# Altium schematic sheet Sheet1.SchDoc
size A3; Organization: Altium Limited; Address1: L3, 12a Rodborough Rd; Address2: Frenchs Forest; Address3: NSW; Address4: Australia 2086
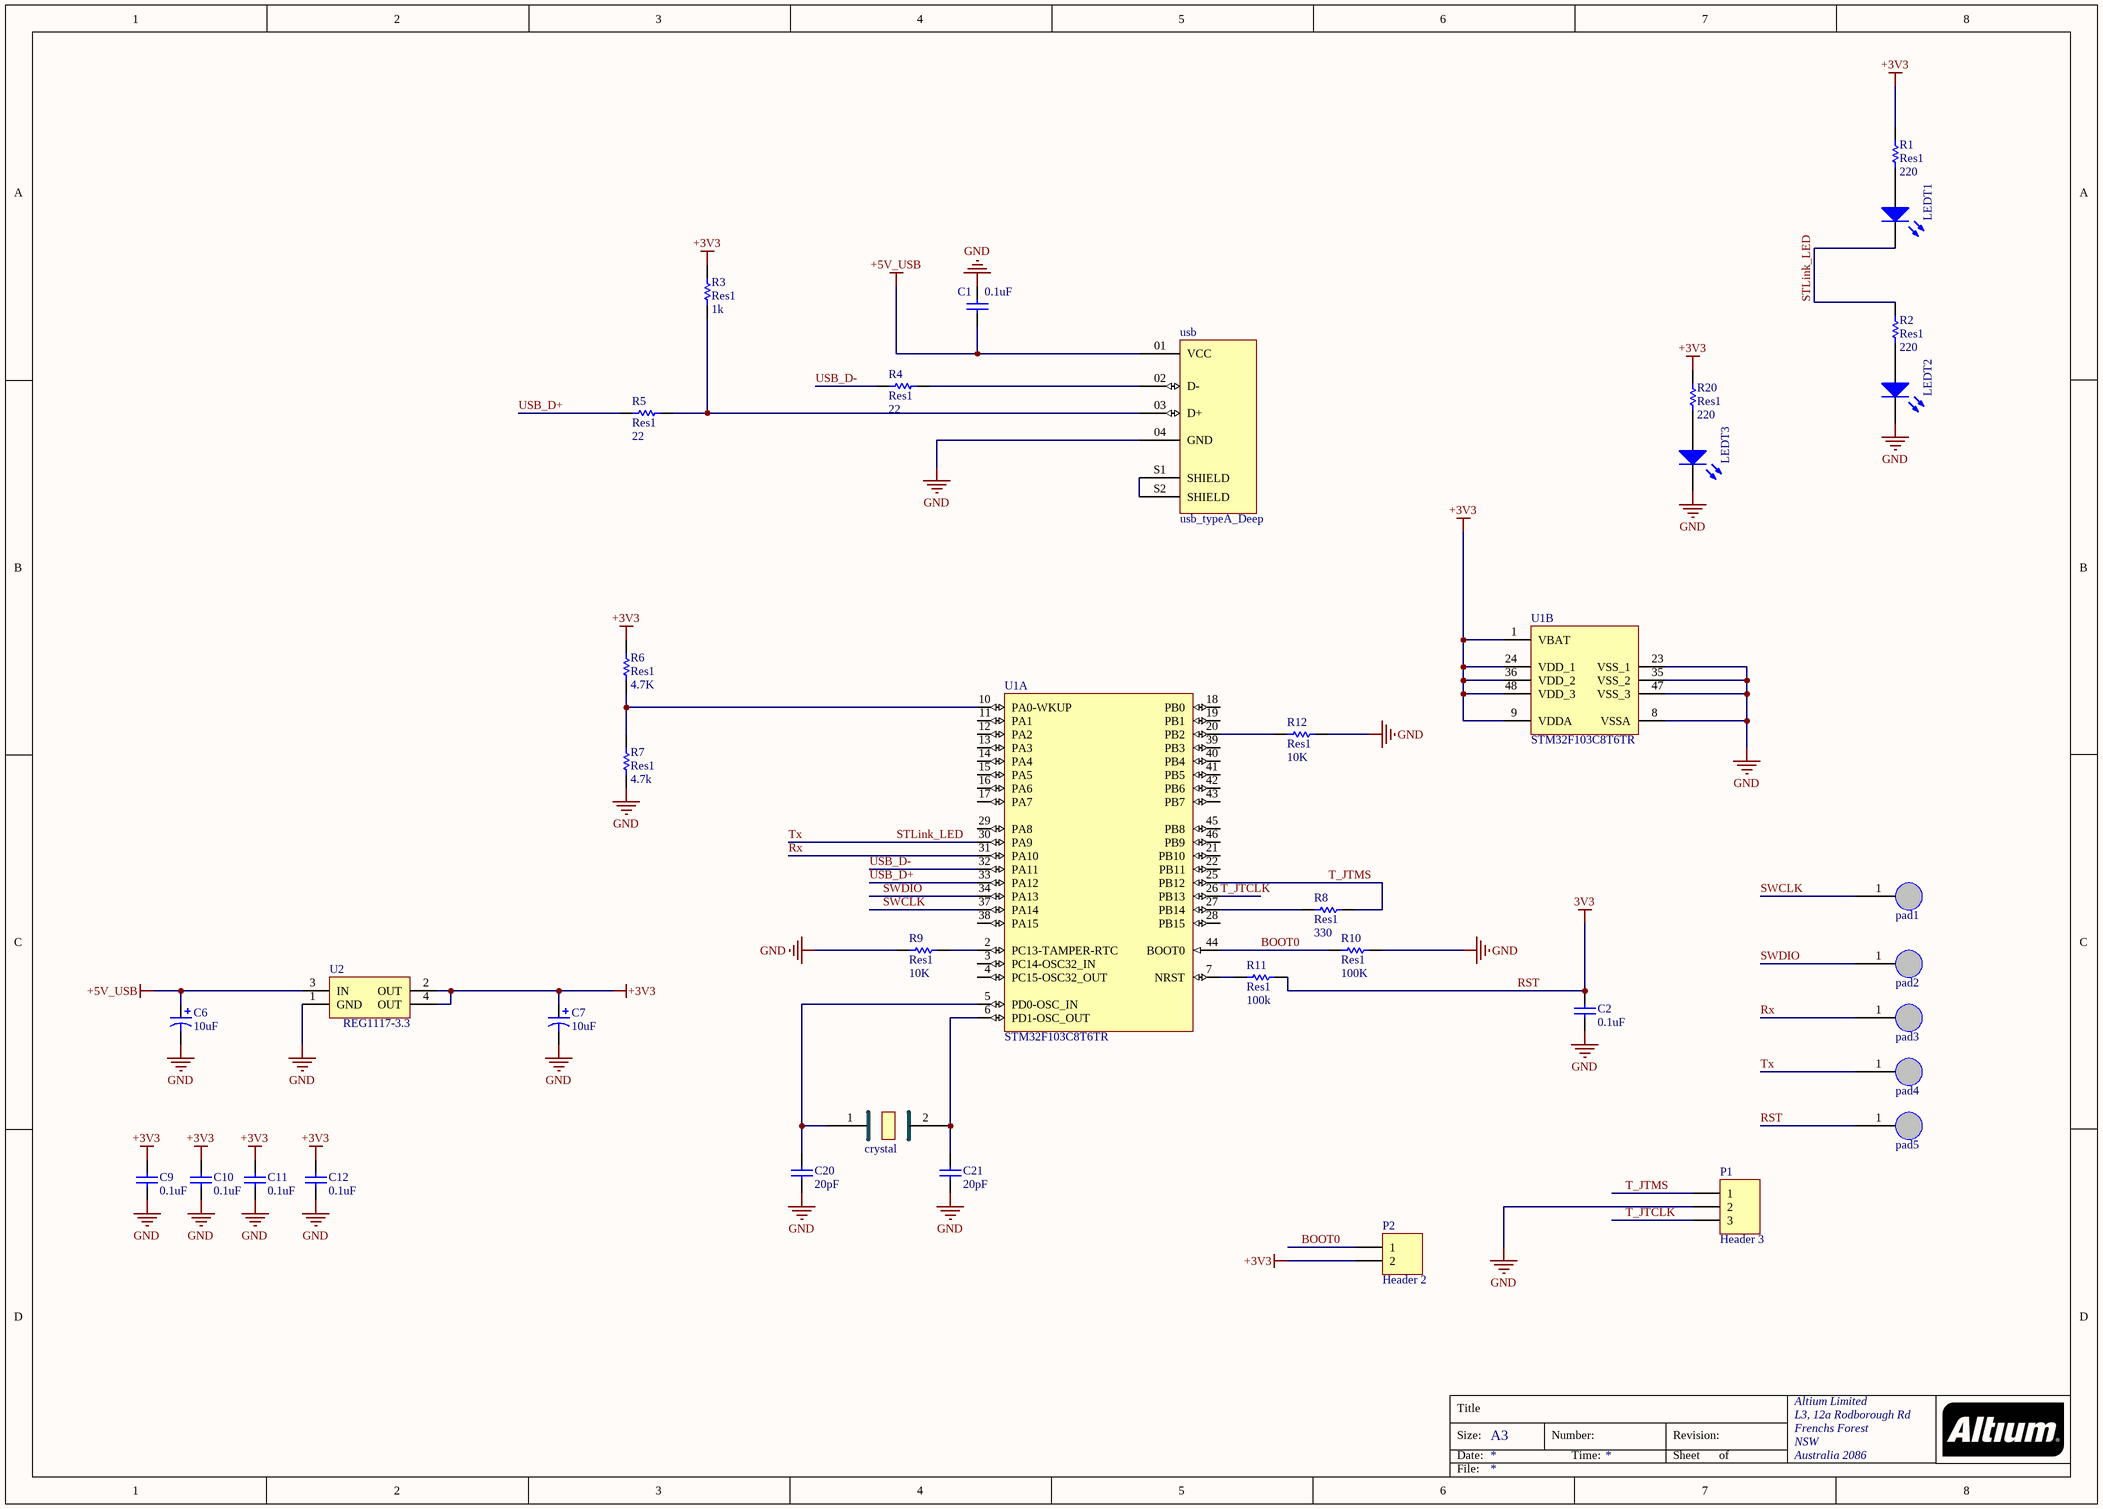
[diagram p0: Sheet1.SchDoc]

## Parts
C1  value 0.1uF  [J1-0603]  (hidden comment: C0603)
C2  value 0.1uF  [J1-0603]  (hidden comment: C0603)
C6  10uF  [J1-0603]
C7  10uF  [J1-0603]
C9  value 0.1uF  [J1-0603]  (hidden comment: C0603)
C10  value 0.1uF  [J1-0603]  (hidden comment: C0603)
C11  value 0.1uF  [J1-0603]  (hidden comment: C0603)
C12  value 0.1uF  [J1-0603]  (hidden comment: C0603)
C20  value 20pF  [J1-0603]  (hidden comment: C0603)
C21  value 20pF  [J1-0603]  (hidden comment: C0603)
crystal  clockProducerDeep  [deep crystal]  (value not drawn)
LEDT1  (no value)  [3518]
LEDT2  (no value)  [3518]
LEDT3  (no value)  [3518]
P1  Header 3  [HDR1X3]
P2  Header 2  [HDR1X2]
pad1  pad  [pad!]  (value not drawn)
pad2  pad  [pad!]  (value not drawn)
pad3  pad  [pad!]  (value not drawn)
pad4  pad  [pad!]  (value not drawn)
pad5  pad  [pad!]  (value not drawn)
R1  Res1  value 220  [j1-0603]
R2  Res1  value 220  [j1-0603]
R3  Res1  value 1k  [J1-0603]
R4  Res1  value 22  [J1-0603]
R5  Res1  value 22  [J1-0603]
R6  Res1  value 4.7K  [J1-0603]
R7  Res1  value 4.7k  [J1-0603]
R8  Res1  value 330  [J1-0603]
R9  Res1  value 10K  [J1-0603]
R10  Res1  value 100K  [J1-0603]
R11  Res1  value 100k  [J1-0603]
R12  Res1  value 10K  [J1-0603]
R20  Res1  value 220  [j1-0603]
U1  STM32F103C8T6TR  [STM-LQFP48_L]  (parts A,B of 2)
U2  REG1117-3.3  [SOT223]
usb  usb_typeA_Deep  [usb_typeA_Deep]

## Nets
+3V3: C7.1 C9.2 C10.2 C11.2 C12.2 P2.2 R1.1 R3.2 R6.2 R20.1 U1.1(VBAT) U1.9(VDDA) U1.24(VDD_1) U1.36(VDD_2) U1.48(VDD_3) U2.2(OUT) U2.4(OUT)
+5V_USB: C1.1 C6.1 U2.3(IN) usb.01(VCC)
GND: C1.2 C2.1 C6.2 C7.2 C9.1 C10.1 C11.1 C12.1 C20.1 C21.1 LEDT2.2(K) LEDT3.2(K) P1.2 R7.1 R9.1 R10.2 R12.2 U1.8(VSSA) U1.23(VSS_1) U1.35(VSS_2) U1.47(VSS_3) U2.1(GND) usb.04(GND)
RST: C2.2 pad5.1 R11.2  [also labelled 3V3]
BOOT0: P2.1 R10.1 U1.44(BOOT0)
Rx: pad3.1 U1.31(PA10)
STLink_LED: LEDT1.2(K) pad4.1 R2.1 U1.30(PA9)  [also labelled Tx]
SWCLK: pad1.1 U1.37(PA14)
SWDIO: pad2.1 U1.34(PA13)
T_JTCLK: P1.3 U1.26(PB13)
T_JTMS: P1.1 R8.2 U1.25(PB12)
USB_D+: R5.2 U1.33(PA12)
USB_D-: R4.2 U1.32(PA11)
NetC20_2: C20.2 crystal.1 U1.5(PD0-OSC_IN)
NetC21_2: C21.2 crystal.2 U1.6(PD1-OSC_OUT)
NetLEDT1_1: LEDT1.1(A) R1.2
NetLEDT2_1: LEDT2.1(A) R2.2
NetLEDT3_1: LEDT3.1(A) R20.2
NetR3_1: R3.1 R5.1 usb.03(D+)
NetR4_1: R4.1 usb.02(D-)
NetR6_1: R6.1 R7.2 U1.10(PA0-WKUP)
NetR8_1: R8.1 U1.27(PB14)
NetR9_2: R9.2 U1.2(PC13-TAMPER-RTC)
NetR11_1: R11.1 U1.7(NRST)
NetR12_1: R12.1 U1.20(PB2)
Netusb_S1: usb.S1(SHIELD) usb.S2(SHIELD)

Not connected (* = marked no-connect by the designer): U1 3(PC14-OSC32_IN) 4(PC15-OSC32_OUT) 11(PA1) 12(PA2) 13(PA3) 14(PA4) 15(PA5) 16(PA6) 17(PA7) 18(PB0) 19(PB1) 21(PB10) 22(PB11) 28(PB15) 29(PA8) 38(PA15) 39(PB3) 40(PB4) 41(PB5) 42(PB6) 43(PB7) 45(PB8) 46(PB9)

## Notes on the sheet
- Title
- Size:
- Date:
- A3
- Number:
- Time:
- Revision:
- Sheet
- of
- File:

## Library data of the parts
C1 C2 C9-C12 C20 C21 = C0603: Ceramic Chip Capacitor - Standard; Note: Footprint corresponds to dimensions for bulk cassette packaging. This case size has tightened tolerances.; Published: 17-Jul-2002; LatestRevisionDate: 19-Mar-2004; LatestRevisionNote: Silkscreen size reduced.; DatasheetDocument: Mar-2001; PackageDocument: Mar-2001; PackageReference: 0603; Publisher: Altium Limited; Code_JEITA: 0603; Code_IPC: 1608 [0603]; ComponentLink1Description: Manufacturer Link; ComponentLink1URL: http://www.kemet.com/; ComponentLink2Description: Datasheet; ComponentLink2URL: http://www.kemet.com/kemet/web/homepage/kechome.nsf/vapubfilesname/F3102TA.pdf/$file/F3102TA.pdf
C6 C7 = 194D105X0015B2: Note: See Data Sheet for full range of components; Value: 1.0uF; Published: 19-Mar-2004; DatasheetDocument: 05-Jul-2002; PackageReference: B; Publisher: Altium Limited; ComponentLink1Description: Manufacturer Link; ComponentLink1URL: http://www.vishay.com/; ComponentLink2Description: Datasheet; ComponentLink2URL: http://www.vishay.com/docs/40000/194d.pdf
crystal = deep crystal
LEDT1-LEDT3 = LED3: Typical BLUE SiC LED; pin to pad: 1>2 2>1; Published: 8-Jun-2000; LatestRevisionDate: 17-Dec-2003; LatestRevisionNote: PCB Footprint replaced.; DatasheetDocument: 16-Apr-2002; PackageDocument: 16-Apr-2002; PackageReference: 3.5X2.8X1.9; Publisher: Altium Limited
P1 = Header 3: Header, 3-Pin; LatestRevisionDate: 17-Jul-2002; LatestRevisionNote: Re-released for DXP Platform.; Publisher: Altium Limited
P2 = Header 2: Header, 2-Pin; LatestRevisionDate: 17-Jul-2002; LatestRevisionNote: Re-released for DXP Platform.; Publisher: Altium Limited
pad1-pad5 = pad!: test pad
R1-R12 R20 = Res1: Resistor; Published: 8-Jun-2000; LatestRevisionDate: 17-Jul-2002; LatestRevisionNote: Re-released for DXP Platform.; PackageReference: AXIAL-0.3; Publisher: Altium Limited
  R3-R12: PackageDescription: Axial Device, Thru-Hole; 2 Leads; 0.3 in Pin Spacing
U1 = STM32F103C8T6TR: ARM Cortex-M3 32-bit MCU, 64 KB Flash, 20 KB Internal RAM, 37 I/Os, 48-pin LQFP, -40 to 85 degC, Tape and Reel; A/D Converter: 2x12-bit (10 Channel); FLASH Size (Prog) (kB): 64; I/Os (High Current): 37; Internal RAM Size (kB): 20; Operating Frequency(F) (Processor speed) (MHz): 72; Supply Voltage(Vcc) min (V): 2; DatasheetVersion: Rev. 16; PackageVersion: Rev. 6, 06/2013; PackageReference: LQFP48; PackageDescription: 48-Pin Low Profile Quad Flat Package, 7 x 7 mm Body, 0.5 mm Pitch; Supplier 1: Digi-Key; Supplier Part Number 1: STM32F103C8T6TR-ND; Supplier 2: Mouser; Supplier Part Number 2: 511-STM32F103C8T6TR; Core: ARM Cortex-M3; Packing: Tape and Reel; Mounting Technology: Surface Mount; PartNumber: STM32F103C8T6TR; ComponentLink1Description: Manufacturer URL; ComponentLink1URL: http://www.st.com/web/en/home.html; ComponentLink2Description: Datasheet; ComponentLink2URL: http://www.st.com/st-web-ui/static/active/en/resource/technical/document/datasheet/CD00161566.pdf; ComponentLink3Description: Package Specification; ComponentLink3URL: http://www.st.com/st-web-ui/static/active/en/resource/technical/document/datasheet/DM00058181.pdf
U2 = REG1117-3.3: 800mA and 1A Low Dropout Positive Regulator 2.85V, 3.3V, 5V, and Adjustable; Published: 8-Jun-2000; LatestRevisionDate: 17-Jul-2002; LatestRevisionNote: Re-released for DXP Platform.; DatasheetVersion: Sep-1997; PackageVersion: revC; PackageReference: ZZ311; Publisher: Altium Limited; PackageDescription: SOT-223/SC-73; 4 Leads; Body 6.7 x 7.3 mm, inc. leads (LxW max); ComponentLink1Description: Manufacturer Link; ComponentLink1URL: http://www.ti.com/; ComponentLink2Description: Datasheet; ComponentLink2URL: http://www-s.ti.com/sc/ds/REG1117.pdf